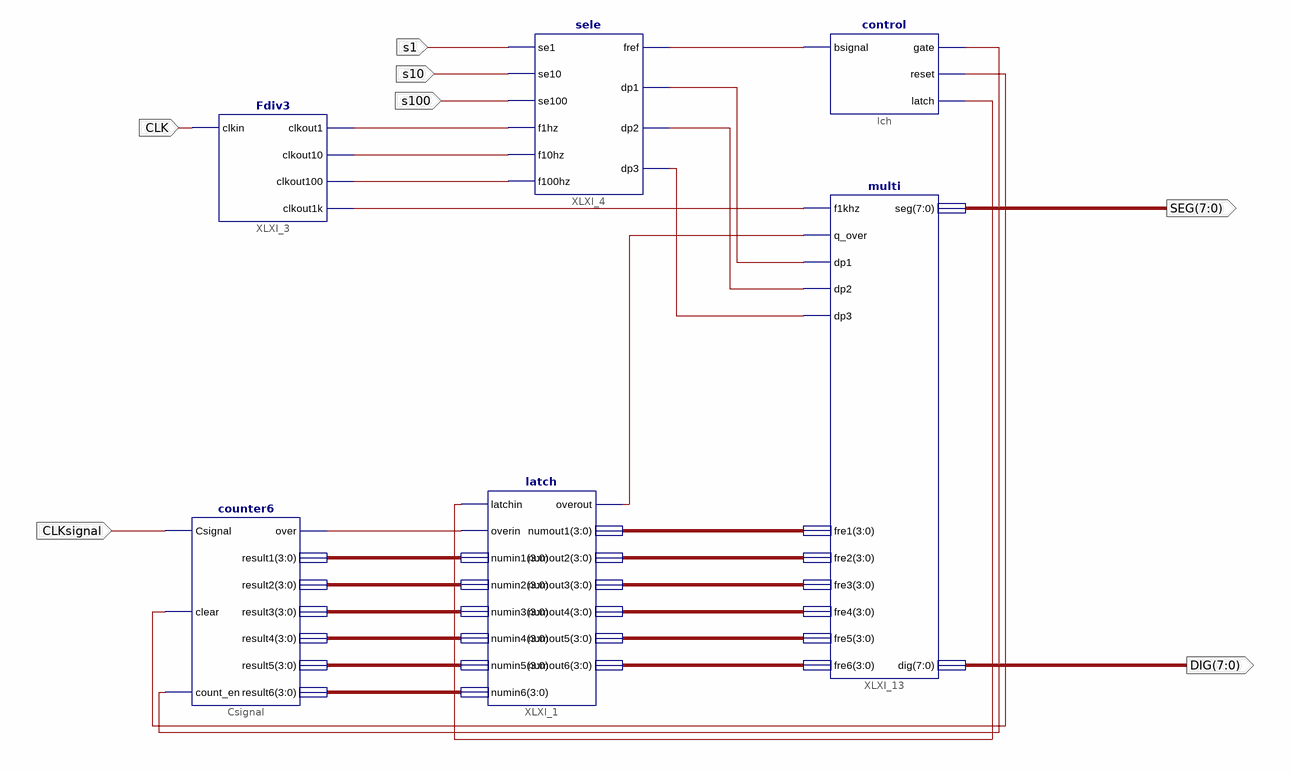
[diagram p0: schematic sheet 1]
// Xilinx ISE schematic latchtop.sch (spartan3e) as structural Verilog: 6 symbols, 7 ports
module latchtop (
  input  CLK,
  input  s1,
  input  s10,
  input  s100,
  input  CLKsignal,
  output [7:0] SEG,
  output [7:0] DIG
);

  wire overout, XLXN_2, XLXN_3, XLXN_4, XLXN_6, XLXN_13, XLXN_29, XLXN_50, XLXN_51, XLXN_52, XLXN_70,
       XLXN_225, XLXN_226;
  wire [3:0] XLXN_14, XLXN_15, XLXN_16, XLXN_17, XLXN_18, XLXN_19, XLXN_31, XLXN_43, XLXN_44, XLXN_45,
       XLXN_46, XLXN_193;

  sele XLXI_4 (
    .se1(s1), .se10(s10), .se100(s100), .f1hz(XLXN_2), .f10hz(XLXN_3), .f100hz(XLXN_4), .fref(XLXN_6),
    .dp1(XLXN_50), .dp2(XLXN_51), .dp3(XLXN_52));
  Fdiv3 XLXI_3 (.clkin(CLK), .clkout1(XLXN_2), .clkout10(XLXN_3), .clkout100(XLXN_4), .clkout1k(XLXN_29));
  control lch (.bsignal(XLXN_6), .gate(XLXN_70), .reset(XLXN_225), .latch(XLXN_226));
  multi XLXI_13 (
    .f1khz(XLXN_29), .q_over(overout), .dp1(XLXN_50), .dp2(XLXN_51), .dp3(XLXN_52), .fre1(XLXN_31),
    .fre2(XLXN_193), .fre3(XLXN_43), .fre4(XLXN_44), .fre5(XLXN_45), .fre6(XLXN_46), .seg(SEG), .dig(DIG));
  counter6 Csignal (
    .Csignal(CLKsignal), .clear(XLXN_225), .count_en(XLXN_70), .over(XLXN_13), .result1(XLXN_14),
    .result2(XLXN_15), .result3(XLXN_16), .result4(XLXN_17), .result5(XLXN_18), .result6(XLXN_19));
  latch XLXI_1 (
    .latchin(XLXN_226), .overin(XLXN_13), .numin1(XLXN_14), .numin2(XLXN_15), .numin3(XLXN_16),
    .numin4(XLXN_17), .numin5(XLXN_18), .numin6(XLXN_19), .overout(overout), .numout1(XLXN_31),
    .numout2(XLXN_193), .numout3(XLXN_43), .numout4(XLXN_44), .numout5(XLXN_45), .numout6(XLXN_46));
endmodule
